# EAGLE design Morse_Code_Watch (EAGLE 8.1.1)
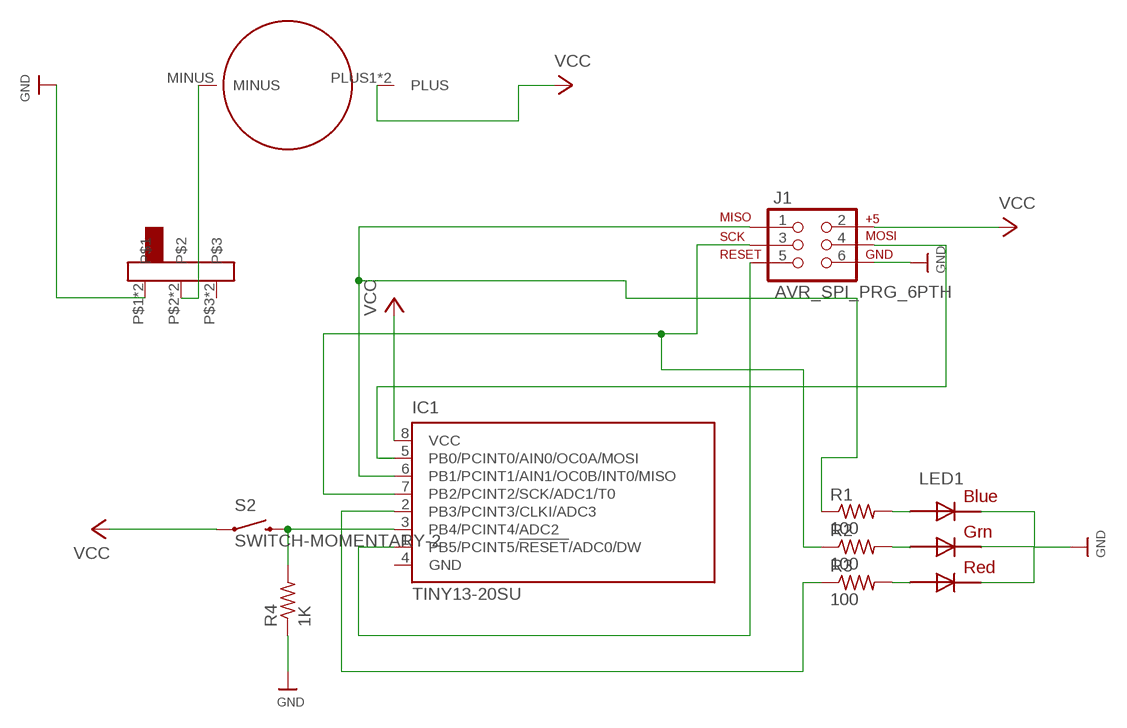
[diagram p0: schematic, sheet 1]

## Parts
IC1  TINY13-20SU  [8S2]
J1  AVR_SPI_PRG_6PTH  [2X3]
LED1  RGBLED5050  [RGBLED5050]
R1  100  R-US_M2012  [M2012]
R2  100  R-US_M2012  [M2012]
R3  100  R-US_M2012  [M2012]
R4  1K  R-US_M2012  [M2012]
S2  SWITCH-MOMENTARY-2  [TACTILE_SWITCH_TALL]
U$1  COIN_3V  [COIN_3V]
U$2  SWITCH_SK-02ACTS-2235S  [SWITCH_CTS-2235S]

## Nets
GND: J1.6 LED1.4(BLUE_C) LED1.5(RED_C) LED1.6(GREEN_C) R4.1 U$2.P$1 U$2.P$4
N$1: IC1.6(PB1/PCINT1/AIN1/OC0B/INT0/MISO) J1.1 R1.1
N$2: IC1.5(PB0/PCINT0/AIN0/OC0A/MOSI) J1.4
N$5: IC1.1(PB5/PCINT5/!RESET!/ADC0/DW) J1.5
N$6: IC1.7(PB2/PCINT2/SCK/ADC1/T0) J1.3 R2.1
N$8: IC1.2(PB3/PCINT3/CLKI/ADC3) R3.1
N$9: IC1.3(PB4/PCINT4/ADC2) R4.2 S2.B1 S2.B2
N$12: LED1.3(BLUE_A) R1.2
N$13: LED1.1(GREEN_A) R2.2
N$14: LED1.2(RED_A) R3.2
N$15: U$1.MINUS U$2.P$2 U$2.P$5
VCC: IC1.8(VCC) J1.2 S2.A1 S2.A2 U$1.PLUS1(PLUS) U$1.PLUS2(PLUS)
Unconnected: U$2.P$3 U$2.P$6

## Power pins joined to a net without a drawn wire
GND: IC1.4(GND)

## Library data of the parts
IC1 = atmel:TINY13: 8-bit AVR Microcontroller with 1K Bytes In-System Programmable Flash Source: http://www.atmel.com/dyn/resources/prod_documents/2535S.pdf; MPN: ATTINY13-20SU; OC_FARNELL: 9171568; OC_NEWARK: 96K6522
J1 = SparkFun-Connectors:AVR_SPI_PRG_6: AVR ISP 6 Pin This is the reduced ISP connector for AVR programming. Common on Arduino. This footprint will take up less PCB space and can be used with a 10-pin to 6-pin adapter such as SKU: BOB-08508
LED1 = adafruit:RGBLED: For 5050 RGB LEDs, the order of the LEDs may vary from one manufacturer to another!
R1-R4 = rcl:R-US_: RESISTOR, American symbol
S2 = SparkFun-Electromechanical:SWITCH-MOMENTARY-2: Various NO switches- pushbuttons, reed, etc
U$1 = Coin_3V:COIN_3V
U$2 = Swtich_NW3-SK-02A:SWITCH_SK-02A

## Board
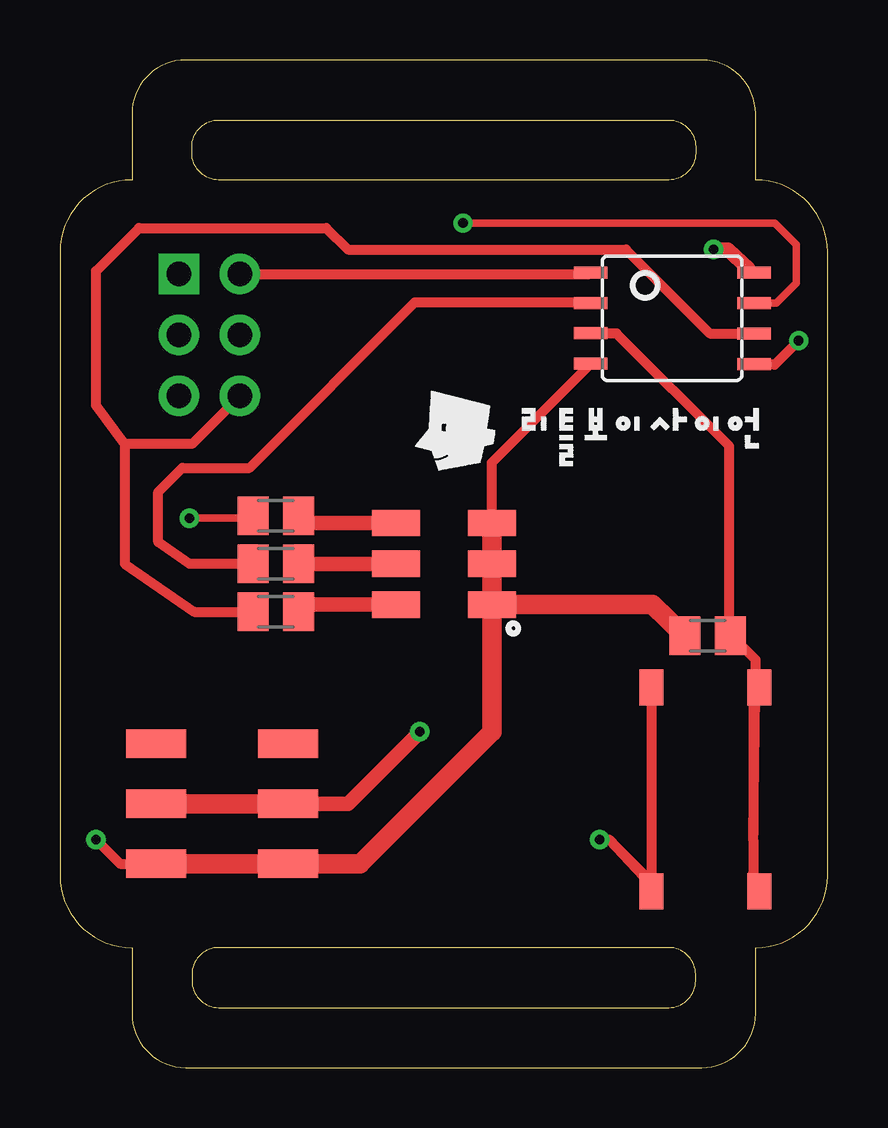
[diagram p1: board, top side]
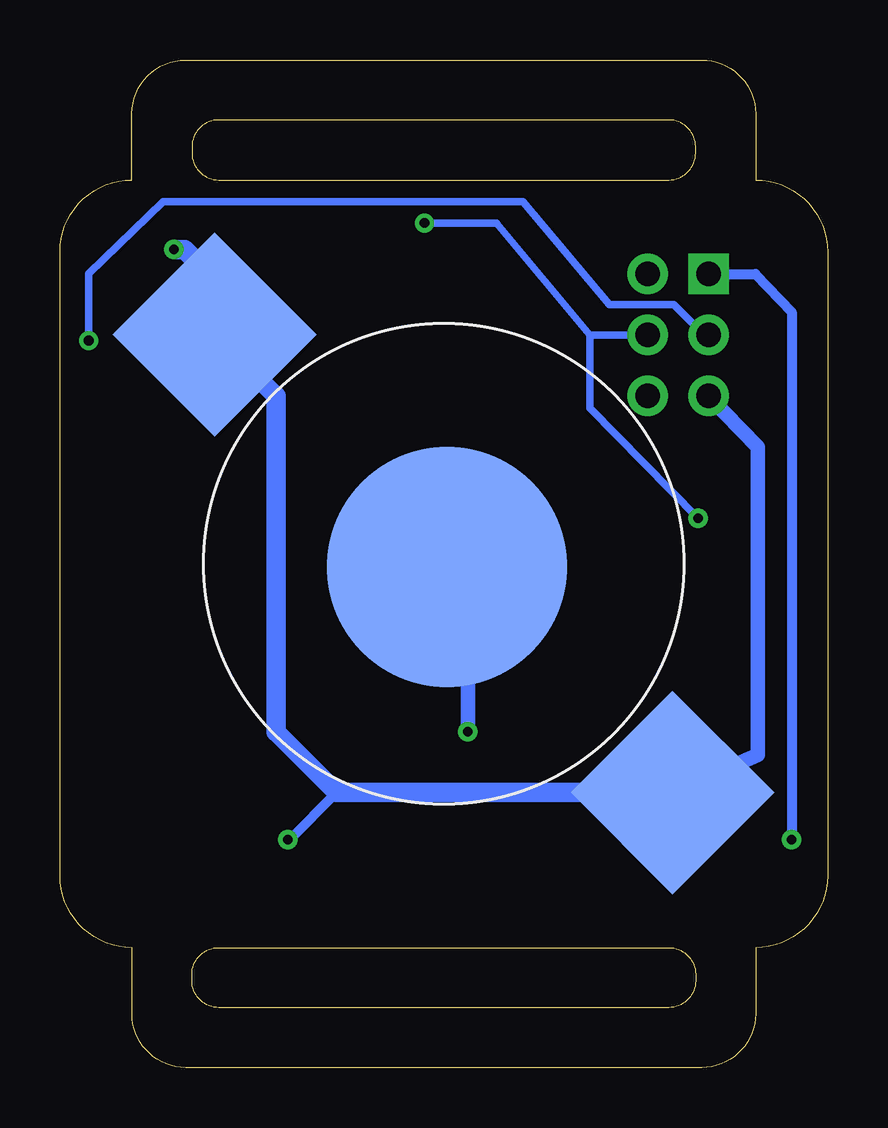
[diagram p2: board, bottom side, seen from below]

Size 32 x 42 mm. Coordinates in mm from the lower left corner, seen from the top.
Outline: 3,37 arc90 0,34 0,8 arc90 3,5 3,2.24 arc90 5.24,0 26.76,0 arc90 29,2.24 29,5 arc90 32,8 32,34 arc90 29,37 29,39.77 arc90 26.77,42 5.24,42 arc90 3,39.76 3,37
Outline: 26.5,38.38 26.5,38.12 arc-90 25.38,37 6.62,37 arc-90 5.5,38.12 5.5,38.38 arc-90 6.62,39.5 25.38,39.5 arc-90 26.5,38.38
Outline: 6.62,2.5 25.38,2.5 arc90 26.5,3.62 26.5,3.88 arc90 25.38,5 6.62,5 arc90 5.5,3.88 5.5,3.62 arc90 6.62,2.5
Copper layers (1*16): Top 0.035mm / dielectric 1.5mm / Bottom 0.035mm
Design rules "default": minimum track width 10mil, minimum drill 24mil, track to track 8mil, track to pad 8mil, pad to pad 8mil, via to via 8mil, smd to smd 8mil, copper to edge 40mil, drill to drill 8mil, minimum pad ring 10mil, minimum via ring 8mil, stop-mask expansion 4mil, vias tented up to drill 0mil, thermal gap 10mil

### Footprints (pad centres in the part's own frame; a part is rotated, then mirrored left to right if it is on the bottom)
8S2 = smd 0.5 x 1.4: 1 -1.905,-3.404; 2 -0.645,-3.404; 3 0.625,-3.404; 4 1.895,-3.404; 5 1.905,3.404; 6 0.635,3.404; 7 -0.635,3.404; 8 -1.905,3.404
2X3 = drill 1.016 pad 1.676: 1 0,0; 2 0,2.54; 3 2.54,0; 4 2.54,2.54; 5 5.08,0 | drill 1.016 pad 1.676 square: 6 5.08,2.54
RGBLED5050 = smd 2 x 1.1: 1 -2,1.7; 2 -2,0; 3 -2,-1.7; 4 2,-1.7; 5 2,0; 6 2,1.7
M2012 = smd 1.3 x 1.6: 1 -0.95,0; 2 0.95,0
TACTILE_SWITCH_TALL = smd 1.5 x 1: A1 -4.24,-2.25; A2 4.26,-2.25; B1 -4.24,2.25; B2 4.26,2.25
COIN_3V = smd 10 x 10: MINUS 0.19,0 | smd 6 x 6: PLUS1 -13.51,0; PLUS2 13.49,0
SWITCH_CTS-2235S = smd 1.2 x 2.5: P$1 -2.5,3; P$2 0,3; P$3 2.5,3; P$4 -2.5,-2.5; P$5 0,-2.5; P$6 2.5,-2.5

### Placement (x,y rotation side)
IC1  25.53,31.23 270 top
J1  7.5,28 90 top
LED1  16,21 0 top
R1  9,19 0 top
R2  9,23 0 top
R3  9,21 0 top
R4  27,18 0 top
S2  26.9,11.6 270 top
U$1  16,21 315 bottom
U$2  7,11 90 top
U$8  [LOGO]  14.8,24.9 0 top

### Tracks (layer width: path | path; a pad name or v marks a point on that pad's centre or on a via)
GND  (via drill 0.4)
  Top 0.406: LED1.6 18,25.21 IC1.4 | v1.5,9.5 2.5,8.5 U$2.P$1
  Top 0.813: U$2.P$1 U$2.P$4 12.5,8.5 18,14 LED1.4 | LED1.6 LED1.5 LED1.4 | LED1.4 24.7,19.3 R4.1
  Bottom 0.406: J1.6 3.01,33.08 1.5,31.5 v1.5,9.5
N$1
  Top 0.254: 28.8,30.6 IC1.6
  Top 0.406: 28.8,30.6 27.1,30.6 23.6,34.1 12,34.1 11.1,35 3.3,35 1.5,33.2 1.5,27.6 2.7,26 | 2.7,26 5.5,26 J1.1 | 2.7,26 2.7,21 5.6,19 R1.1
N$2  (via drill 0.4)
  Top 0.406: v30.8,30.3 29.8,29.3 28.96,29.3 IC1.5
  Bottom 0.305: v30.8,30.3 30.8,33.1 27.7,36.1 12.7,36.1 9.1,31.8 6.4,31.8 5.14,30.54 J1.4
N$5
  Top 0.406: J1.5 22.07,33.08 IC1.1
N$6  (via drill 0.4)
  Top 0.254: 8.1,23.1 R2.1
  Top 0.305: IC1.7 29.86,31.86 30.7,32.7 30.7,34.3 29.8,35.2 v16.8,35.2 | 7.6,22.9 v5.4,22.9
  Top 0.406: 8.1,23.1 7.6,22.9
  Bottom 0.305: J1.3 7.59,30.54 8.96,30.54 9.85,30.54 9.91,30.54 | v5.4,22.9 9.9,27.5 9.91,30.54 | v16.8,35.2 13.8,35.2 9.91,30.54 | 9.01,30.54 9.02,30.54
N$8
  Top 0.254: 22,31.9 IC1.2 | 7.8,21 R3.1
  Top 0.406: 22,31.9 14.8,31.9 7.9,25 5.1,25 4.1,24 4.1,21.9 5.4,21 7.8,21
N$9
  Top 0.254: 22.2,30.6 IC1.3 | 27.9,18 R4.2
  Top 0.406: R4.2 28,18 29,17 28.9,9.7 | 22.2,30.6 23.2,30.6 27.9,25.9 27.9,18 | 28.9,9.7 28.9,9.5 28.9,8.1 | S2.B1 28.9,15.84 28.9,9.7 | 28.9,8 28.9,8.1 | 28.9,8.1 28.95,7.5 S2.B2
N$12
  Top 0.61: LED1.3 10.25,19.3 R1.2
N$13
  Top 0.61: LED1.1 10.25,22.7 R2.2
N$14
  Top 0.61: LED1.2 R3.2
N$15  (via drill 0.4)
  Top 0.61: U$2.P$5 12,11 v15,14
  Top 0.813: U$2.P$2 U$2.P$5
  Bottom 0.61: U$1.MINUS 15,20.27 v15,14
VCC  (via drill 0.4)
  Top 0.406: 28.7,33.3 IC1.8 | 24.59,7.7 24.9,7.5 22.9,9.5 | 22.9,9.5 v22.5,9.5 | 22.9,9.5 24.9,7.34 S2.A2 S2.A1
  Top 0.61: 28.7,33.3 27.85,34.1 v27.25,34.1
  Bottom 0.254: 24.54,30.6 24.9,30.6 25.2,30.6 U$1.PLUS1
  Bottom 0.406: v22.5,9.5 22.42,9.5 20.46,11.46
  Bottom 0.61: J1.2 2.9,25.86 2.9,13.02 U$1.PLUS2
  Bottom 0.813: 24.54,30.54 24.54,30.6 25.5,32.8 26.8,34.1 v27.25,34.1 | U$1.PLUS2 20.46,11.46 23,14 23,28 U$1.PLUS1